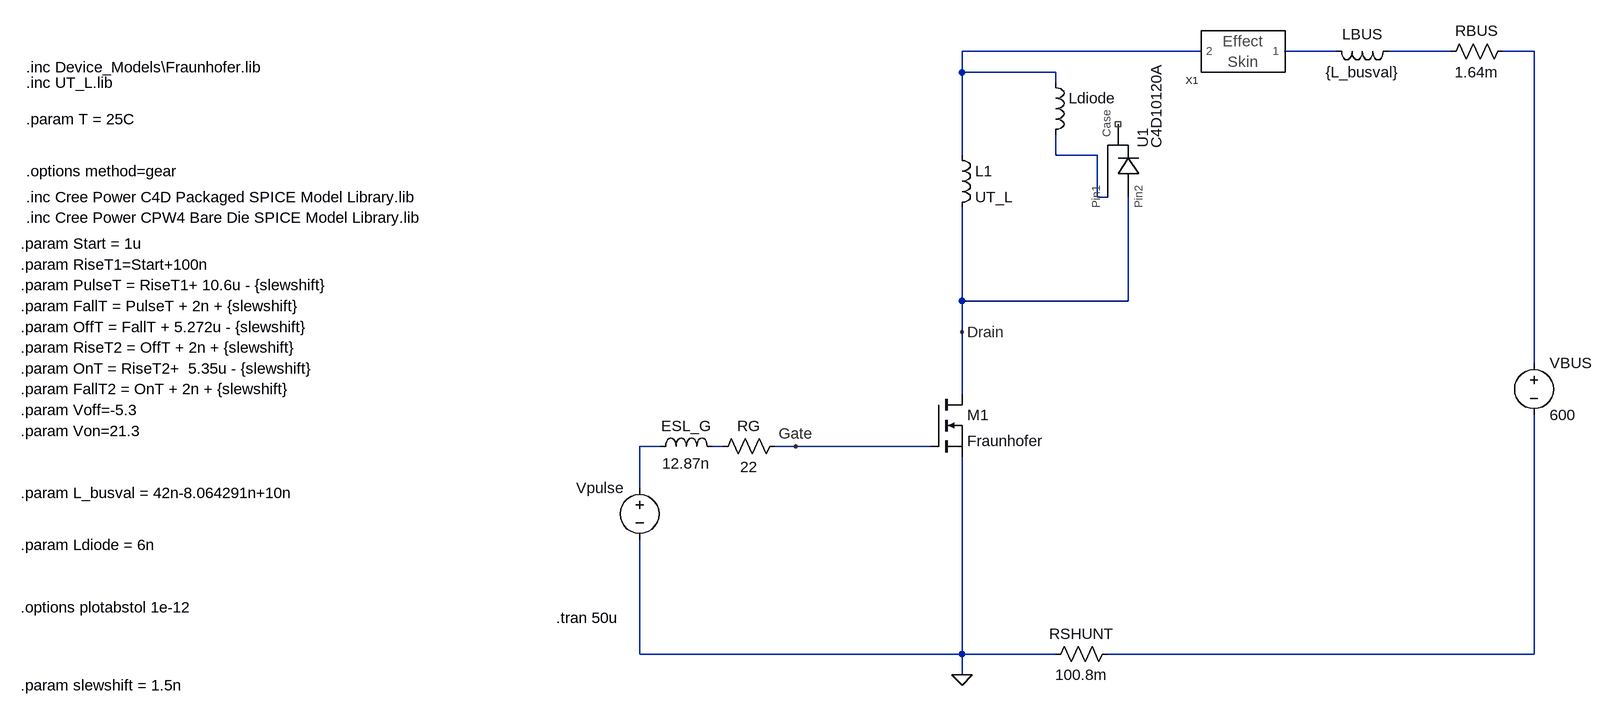
[diagram p0: schematic Test5.asc]
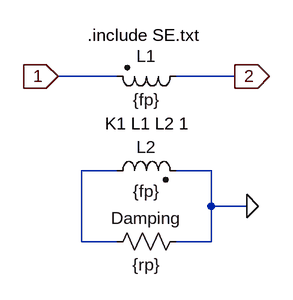
[diagram p1: sub-circuit skin_effect.asc]
Test5.asc, the LTspice schematic file:
Version 4
SHEET 1 2916 680
WIRE 896 -720 528 -720
WIRE 1104 -720 1024 -720
WIRE 1280 -720 1184 -720
WIRE 1408 -720 1360 -720
WIRE 528 -688 528 -720
WIRE 672 -688 528 -688
WIRE 672 -672 672 -688
WIRE 528 -560 528 -688
WIRE 672 -560 672 -592
WIRE 736 -560 672 -560
WIRE 736 -496 736 -560
WIRE 752 -496 736 -496
WIRE 528 -336 528 -480
WIRE 784 -336 784 -496
WIRE 784 -336 528 -336
WIRE 528 -288 528 -336
WIRE 1408 -240 1408 -720
WIRE 528 -192 528 -288
WIRE 64 -112 32 -112
WIRE 160 -112 144 -112
WIRE 272 -112 240 -112
WIRE 480 -112 272 -112
WIRE 32 -48 32 -112
WIRE 32 208 32 32
WIRE 528 208 528 -96
WIRE 528 208 32 208
WIRE 672 208 528 208
WIRE 1408 208 1408 -160
WIRE 1408 208 752 208
WIRE 528 240 528 208
FLAG 272 -112 Gate
FLAG 528 -288 Drain
FLAG 528 240 0
SYMBOL voltage 1408 -256 R0
WINDOW 123 0 0 Left 2
WINDOW 39 0 0 Left 2
SYMATTR InstName VBUS
SYMATTR Value 600
SYMBOL res 256 -128 R90
WINDOW 0 0 56 VBottom 2
WINDOW 3 32 56 VTop 2
SYMATTR InstName RG
SYMATTR Value 22
SYMBOL res 1376 -736 R90
WINDOW 0 0 56 VBottom 2
WINDOW 3 32 56 VTop 2
SYMATTR InstName RBUS
SYMATTR Value 1.64m
SYMBOL ind 48 -96 R270
WINDOW 0 32 56 VTop 2
WINDOW 3 5 56 VBottom 2
SYMATTR InstName ESL_G
SYMATTR Value 12.87n
SYMBOL voltage 32 -64 M0
WINDOW 123 0 0 Left 2
WINDOW 39 24 44 Left 2
WINDOW 3 -1448 60 Invisible 2
SYMATTR Value PWL(0u {Voff} {Start} {Voff} {RiseT1} {Von} {PulseT} {Von} {FallT} {Voff} {offT} {Voff} {RiseT2} {Von} {OnT} {Von} {FallT2} {Voff})
SYMATTR InstName Vpulse
SYMBOL C4D10120A 768 -560 R270
SYMATTR InstName U1
SYMBOL nmos 480 -192 R0
SYMATTR InstName M1
SYMATTR Value Fraunhofer
SYMATTR Prefix X
SYMBOL res 768 192 R90
WINDOW 0 0 56 VBottom 2
WINDOW 3 32 56 VTop 2
SYMATTR InstName RSHUNT
SYMATTR Value 100.8m
SYMBOL Skin_Effect 960 -720 R180
SYMATTR InstName X1
SYMBOL ind 1200 -736 R90
WINDOW 0 5 56 VBottom 2
WINDOW 3 32 56 VTop 2
SYMATTR InstName LBUS
SYMATTR Value {L_busval}
SYMBOL ind 656 -688 R0
WINDOW 3 36 80 Invisible 2
SYMATTR Value {Ldiode}
SYMATTR InstName Ldiode
SYMBOL ind 512 -576 R0
SYMATTR InstName L1
SYMATTR Value UT_L
SYMATTR Prefix X
TEXT -920 -424 Left 2 !.param Start = 1u
TEXT -920 -168 Left 2 !.param Voff=-5.3
TEXT -920 -360 Left 2 !.param PulseT = RiseT1+ 10.6u - {slewshift}
TEXT -920 -328 Left 2 !.param FallT = PulseT + 2n + {slewshift}
TEXT -920 -296 Left 2 !.param OffT = FallT + 5.272u - {slewshift}
TEXT -920 -264 Left 2 !.param RiseT2 = OffT + 2n + {slewshift}
TEXT -920 -232 Left 2 !.param OnT = RiseT2+  5.35u - {slewshift}
TEXT -920 -200 Left 2 !.param FallT2 = OnT + 2n + {slewshift}
TEXT -920 -136 Left 2 !.param Von=21.3
TEXT -920 -392 Left 2 !.param RiseT1=Start+100n
TEXT -912 -536 Left 2 !.options method=gear
TEXT -912 -496 Left 2 !.inc Cree Power C4D Packaged SPICE Model Library.lib
TEXT -912 -464 Left 2 !.inc Cree Power CPW4 Bare Die SPICE Model Library.lib
TEXT -96 152 Left 2 !.tran 50u
TEXT -912 -616 Left 2 !.param T = 25C
TEXT -920 -40 Left 2 !.param L_busval = 42n-8.064291n+10n
TEXT -920 40 Left 2 !.param Ldiode = 6n
TEXT -920 136 Left 2 !.options plotabstol 1e-12
TEXT -920 256 Left 2 !.param slewshift = 1.5n
TEXT -912 -672 Left 2 !.inc UT_L.lib
TEXT -912 -696 Left 2 !.inc Device_Models\\Fraunhofer.lib

skin_effect.asc, the sub-circuit schematic file:
Version 4
SHEET 1 880 680
WIRE 128 80 48 80
WIRE 288 80 208 80
WIRE 128 208 80 208
WIRE 256 208 208 208
WIRE 256 256 256 208
WIRE 304 256 256 256
WIRE 80 304 80 208
WIRE 128 304 80 304
WIRE 256 304 256 256
WIRE 256 304 208 304
FLAG 48 80 1
IOPIN 48 80 In
FLAG 288 80 2
IOPIN 288 80 Out
FLAG 304 256 0
SYMBOL ind2 224 64 R90
WINDOW 0 4 56 VBottom 2
WINDOW 3 32 56 VTop 2
SYMATTR InstName L1
SYMATTR Value {fp}
SYMBOL ind2 112 224 R270
WINDOW 0 32 56 VTop 2
WINDOW 3 4 56 VBottom 2
SYMATTR InstName L2
SYMATTR Value {fp}
SYMBOL res 224 288 R90
WINDOW 0 0 56 VBottom 2
WINDOW 3 32 56 VTop 2
SYMATTR InstName Damping
SYMATTR Value {rp}
TEXT 112 144 Left 2 !K1 L1 L2 1
TEXT 88 24 Left 2 !.include SE.txt

The netlist it stands for:
* Test5.asc
VBUS N004 N008 600
RG Gate N007 22
RBUS N004 N003 1.64m
L§ESL_G N006 N007 12.87n
Vpulse N006 0 PWL(0u {Voff} {Start} {Voff} {RiseT1} {Von} {PulseT} {Von} {FallT} {Voff} {offT} {Voff} {RiseT2} {Von} {OnT} {Von} {FallT2} {Voff})
XU1 Drain N005 NC_01 C4D10120A  ; pins Pin2 Pin1 Case
XM1 Drain Gate 0 Fraunhofer  ; pins D G S
RSHUNT N008 0 100.8m
XX1 N002 N001 skin_effect
LBUS N003 N002 {L_busval}
Ldiode N001 N005 {Ldiode}
XL1 N001 Drain UT_L  ; pins A B

* block symbol definitions
.subckt skin_effect 1 2
L1 2 1 {fp}
L2 N001 0 {fp}
R§Damping 0 N001 {rp}
K1 L1 L2 1
.include SE.txt
.ends skin_effect

.param Start = 1u
.param Voff=-5.3
.param PulseT = RiseT1+ 10.6u - {slewshift}
.param FallT = PulseT + 2n + {slewshift}
.param OffT = FallT + 5.272u - {slewshift}
.param RiseT2 = OffT + 2n + {slewshift}
.param OnT = RiseT2+  5.35u - {slewshift}
.param FallT2 = OnT + 2n + {slewshift}
.param Von=21.3
.param RiseT1=Start+100n
.options method=gear
.inc Cree Power C4D Packaged SPICE Model Library.lib
.inc Cree Power CPW4 Bare Die SPICE Model Library.lib
.tran 50u
.param T = 25C
.param L_busval = 42n-8.064291n+10n
.param Ldiode = 6n
.options plotabstol 1e-12
.param slewshift = 1.5n
.inc UT_L.lib
.inc Device_Models\Fraunhofer.lib
.backanno
.end